# EAGLE design RLCD_SCH_28LED_v1p13p2 (EAGLE 7.1.0)
DATABASE: ../../../../../Documents/eagle/mouserdb.txt
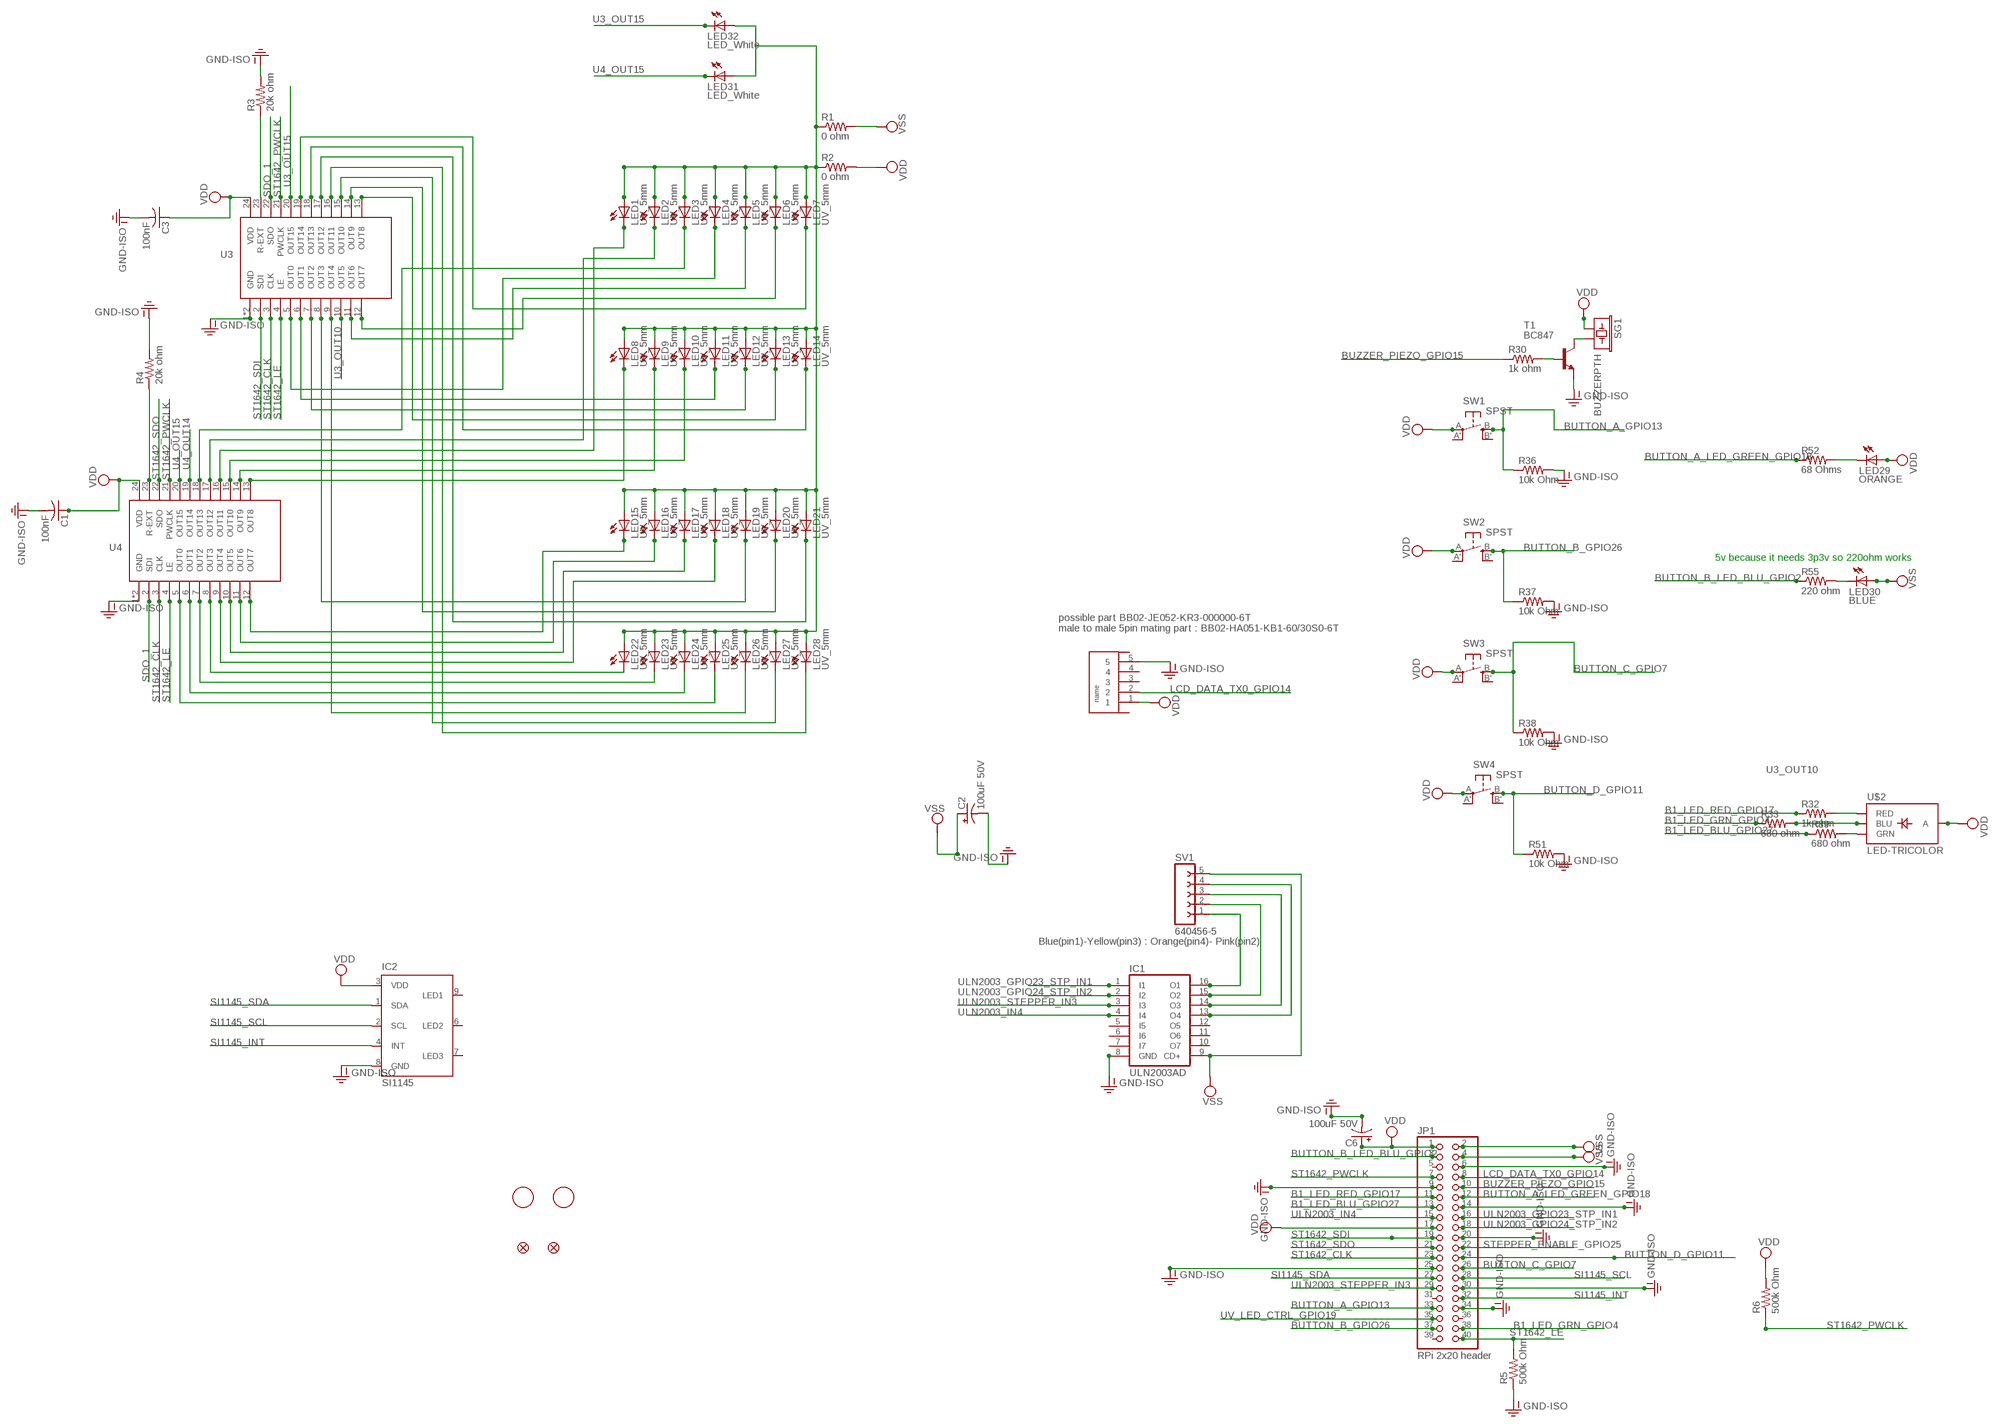
[diagram p0: schematic, sheet 1]

## Parts
C1  100nF  C-USC0805  [C0805]
C2  100uF 50V  CPOL-USE3.5-8  [E3,5-8]
C3  100nF  C-USC0805  [C0805]
C6  100uF 50V  CPOL-USE3.5-8  [E3,5-8]
FID1  FIDUCIAL1X2  [FIDUCIAL-1X2]
FID2  FIDUCIAL1X2  [FIDUCIAL-1X2]
IC1  ULN2003AD  [SO16]
IC2  SI1145  [QFN-10]
JP1  RPi 2x20 header  PINHD-2X20  [2X20]
LED1  UV_5mm  LED5MM  [LED5MM]
LED2  UV_5mm  LED5MM  [LED5MM]
LED3  UV_5mm  LED5MM  [LED5MM]
LED4  UV_5mm  LED5MM  [LED5MM]
LED5  UV_5mm  LED5MM  [LED5MM]
LED6  UV_5mm  LED5MM  [LED5MM]
LED7  UV_5mm  LED5MM  [LED5MM]
LED8  UV_5mm  LED5MM  [LED5MM]
LED9  UV_5mm  LED5MM  [LED5MM]
LED10  UV_5mm  LED5MM  [LED5MM]
LED11  UV_5mm  LED5MM  [LED5MM]
LED12  UV_5mm  LED5MM  [LED5MM]
LED13  UV_5mm  LED5MM  [LED5MM]
LED14  UV_5mm  LED5MM  [LED5MM]
LED15  UV_5mm  LED5MM  [LED5MM]
LED16  UV_5mm  LED5MM  [LED5MM]
LED17  UV_5mm  LED5MM  [LED5MM]
LED18  UV_5mm  LED5MM  [LED5MM]
LED19  UV_5mm  LED5MM  [LED5MM]
LED20  UV_5mm  LED5MM  [LED5MM]
LED21  UV_5mm  LED5MM  [LED5MM]
LED22  UV_5mm  LED5MM  [LED5MM]
LED23  UV_5mm  LED5MM  [LED5MM]
LED24  UV_5mm  LED5MM  [LED5MM]
LED25  UV_5mm  LED5MM  [LED5MM]
LED26  UV_5mm  LED5MM  [LED5MM]
LED27  UV_5mm  LED5MM  [LED5MM]
LED28  UV_5mm  LED5MM  [LED5MM]
LED29  ORANGE  LEDCHIPLED_1206  [CHIPLED_1206]
LED30  BLUE  LEDCHIPLED_1206  [CHIPLED_1206]
LED31  LED_White  LEDCHIPLED_1206  [CHIPLED_1206]
LED32  LED_White  LEDCHIPLED_1206  [CHIPLED_1206]
R1  0 ohm  RESISTOR0805-RES  [0805]
R2  0 ohm  RESISTOR0805-RES  [0805]
R3  20k ohm  RESISTOR0805-RES  [0805]
R4  20k ohm  RESISTOR0805-RES  [0805]
R5  500k Ohm  RESISTOR0805-RES  [0805]
R6  500k Ohm  RESISTOR0805-RES  [0805]
R30  1k ohm  RESISTOR0805-RES  [0805]
R32  1k ohm  RESISTOR0805-RES  [0805]
R33  680 ohm  RESISTOR0805-RES  [0805]
R36  10k Ohm  RESISTOR0805-RES  [0805]
R37  10k Ohm  RESISTOR0805-RES  [0805]
R38  10k Ohm  RESISTOR0805-RES  [0805]
R39  680 ohm  RESISTOR0805-RES  [0805]
R51  10k Ohm  RESISTOR0805-RES  [0805]
R52  68 Ohms  RESISTOR0805-RES  [0805]
R55  220 ohm  RESISTOR0805-RES  [0805]
SG1  BUZZERPTH  [BUZZER-12MM]
SV1  640456-5  FE05-1  [FE05-1]
SV3_LCD_HEADER  22-05-2051  MDF7-5S-2.54DSA  [MDF7-5S-2.54DSA]
SW1  SPST  SPST_TACT-EVQQ2  [EVQ-Q2]
SW2  SPST  SPST_TACT-EVQQ2  [EVQ-Q2]
SW3  SPST  SPST_TACT-EVQQ2  [EVQ-Q2]
SW4  SPST  SPST_TACT-EVQQ2  [EVQ-Q2]
T1  BC847  [SOT23]
U$1  FIDUCIAL  [FIDUCIAL_1MM]
U$2  LED-TRICOLOR  [LED-TRICOLOR-SMD]
U$3  LED1642GWTTR  [TSSOP24]
U$4  LED1642GWTTR  [TSSOP24]
U$5  FIDUCIAL  [FIDUCIAL_1MM]

## Nets
B1_LED_BLU_GPIO27: JP1.13 R39.1
B1_LED_GRN_GPIO4: JP1.38 R33.1
B1_LED_RED_GPIO17: JP1.11 R32.1
BUTTON_A_GPIO13: JP1.33 R36.1 SW1.B(S)
BUTTON_A_LED_GREEN_GPIO18: JP1.12 R52.1
BUTTON_B_GPIO26: JP1.37 R37.1 SW2.B(S)
BUTTON_B_LED_BLU_GPIO2: JP1.3 R55.1
BUTTON_C_GPIO7: JP1.26 R38.1 SW3.B(S)
BUTTON_D_GPIO11: JP1.24 R51.1 SW4.B(S)
BUZZER_PIEZO_GPIO15: JP1.10 R30.1
GND-ISO [GND-ISO]: C1.2 C2.- C3.2 C6.- IC1.8(GND) IC2.8(GND) JP1.6 JP1.9 JP1.14 JP1.20 JP1.25 JP1.30 JP1.34 R3.2 R4.2 R5.1 R36.2 R37.2 R38.2 R51.2 SV3_LCD_HEADER.5 T1.2(E) U$3.1(GND) U$3.P$100(GND) U$4.1(GND) U$4.P$100(GND)
LCD_DATA_TX0_GPIO14: JP1.8 SV3_LCD_HEADER.2
LED+: LED1.A LED2.A LED3.A LED4.A LED5.A LED6.A LED7.A LED8.A LED9.A LED10.A LED11.A LED12.A LED13.A LED14.A LED15.A LED16.A LED17.A LED18.A LED19.A LED20.A LED21.A LED22.A LED23.A LED24.A LED25.A LED26.A LED27.A LED28.A LED31.A LED32.A R1.1 R2.1
N$1: LED2.K(C) U$4.17(OUT12)
N$2: LED3.K(C) U$4.18(OUT13)
N$3: LED6.K(C) U$3.12(OUT7)
N$4: LED4.K(C) U$3.5(OUT0)
N$5: LED5.K(C) U$3.11(OUT6)
N$6: LED22.K(C) U$4.8(OUT3)
N$7: LED15.K(C) U$4.12(OUT7)
N$8: R3.1 U$3.23(R-EXT)
N$9: LED16.K(C) U$4.11(OUT6)
N$10: LED17.K(C) U$4.10(OUT5)
N$11: LED18.K(C) U$4.9(OUT4)
N$12: R4.1 U$4.23(R-EXT)
N$13: LED19.K(C) U$3.8(OUT3)
N$14: LED11.K(C) U$3.6(OUT1)
N$15: LED9.K(C) U$4.14(OUT9)
N$16: LED10.K(C) U$4.15(OUT10)
N$17: LED20.K(C) U$3.14(OUT9)
N$18: LED12.K(C) U$3.7(OUT2)
N$19: R39.2 U$2.G(GRN)
N$20: LED14.K(C) U$3.18(OUT13)
N$21: LED21.K(C) U$3.17(OUT12)
N$23: LED23.K(C) U$4.7(OUT2)
N$24: LED24.K(C) U$4.6(OUT1)
N$25: LED25.K(C) U$4.5(OUT0)
N$26: LED26.K(C) U$3.9(OUT4)
N$27: LED27.K(C) U$3.15(OUT10)
N$28: LED28.K(C) U$3.16(OUT11)
N$29: LED13.K(C) U$3.13(OUT8)
N$30: R30.2 T1.1(B)
N$31: IC1.13(O4) SV1.4
N$33: SG1.- T1.3(C)
N$36: LED7.K(C) U$3.19(OUT14)
N$37: R33.2 U$2.B(BLU)
N$38: IC1.14(O3) SV1.3
N$39: LED29.C R52.2
N$40: LED30.C R55.2
N$41: LED8.K(C) U$4.13(OUT8)
N$47: LED1.K(C) U$4.16(OUT11)
N$58: IC1.16(O1) SV1.1
N$59: IC1.15(O2) SV1.2
SDO_1: U$3.22(SDO) U$4.2(SDI)
SI1145_INT: IC2.4(INT) JP1.32
SI1145_SCL: IC2.2(SCL) JP1.28
SI1145_SDA: IC2.1(SDA) JP1.27
ST1642_CLK: JP1.23 U$3.3(CLK) U$4.3(CLK)
ST1642_LE: JP1.40 R5.2 U$3.4(LE) U$4.4(LE)
ST1642_PWCLK: JP1.7 R6.1 U$3.21(PWCLK) U$4.21(PWCLK)
ST1642_SDI: JP1.19 U$3.2(SDI)
ST1642_SDO: JP1.21 U$4.22(SDO)
STEPPER_ENABLE_GPIO25: JP1.22
U3_OUT10: R32.2 U$2.R(RED) U$3.10(OUT5)
U3_OUT15: LED32.C U$3.20(OUT15)
U4_OUT14: U$4.19(OUT14)
U4_OUT15: LED31.C U$4.20(OUT15)
ULN2003_GPIO23_STP_IN1: IC1.1(I1) JP1.16
ULN2003_GPIO24_STP_IN2: IC1.2(I2) JP1.18
ULN2003_IN4: IC1.4(I4) JP1.15
ULN2003_STEPPER_IN3: IC1.3(I3) JP1.29
UV_LED_CTRL_GPIO19: JP1.35
VDD: C1.1 C3.1 C6.+ IC2.3(VDD) JP1.1 JP1.17 LED29.A R2.2 R6.2 SG1.+ SV3_LCD_HEADER.1 SW1.A(P) SW2.A(P) SW3.A(P) SW4.A(P) U$2.A U$3.24(VDD) U$4.24(VDD)
VSS: C2.+ IC1.9(CD+) JP1.2 JP1.4 LED30.A R1.2 SV1.5
Unconnected: IC1.5(I5) IC1.6(I6) IC1.7(I7) IC1.10(O7) IC1.11(O6) IC1.12(O5) IC2.6(LED2) IC2.7(LED3) IC2.9(LED1) JP1.5 JP1.31 JP1.36 JP1.39 SV3_LCD_HEADER.3 SV3_LCD_HEADER.4 SW1.A'(P1) SW1.B'(S1) SW2.A'(P1) SW2.B'(S1) SW3.A'(P1) SW3.B'(S1) SW4.A'(P1) SW4.B'(S1)

## Notes on the sheet
- U3
- U4
- 5v because it needs 3p3v so 220ohm works
- possible part BB02-JE052-KR3-000000-6T
  male to male 5pin mating part : BB02-HA051-KB1-60/30S0-6T
- Blue(pin1)-Yellow(pin3) : Orange(pin4)- Pink(pin2)

## Library data of the parts
C1 C3 = resistor:C-US: CAPACITOR, American symbol
C2 C6 = adafruit:CPOL-US: POLARIZED CAPACITOR, American symbol; PARTNO: REA101M1HBK-0811P
FID1 FID2 = SparkFun-Aesthetics:FIDUCIAL: Fiducial Alignment Points Various fiducial points for machine vision alignment.
IC1 = uln-udn:ULN2003A: DRIVER ARRAY
IC2 = silabs:SI114*: PROXIMITY/UV/AMBIENT LIGHT SENSOR IC WITH I2C INTERFACE Source: http://www.silabs.com/Support%20Documents/TechnicalDocs/Si1145-46-47.pdf
JP1 = adafruit:PINHD-2X20: PIN HEADER; PARTNO: 929975-01-13-RK
LED1-LED28 = led:LED: LED; PARTNO: *
LED29 LED31 LED32 = adafruit:LED: LED; PARTNO: LG N971-KN-1
LED30 = adafruit:LED: LED; PARTNO: LTST-C21TBKT
R1-R4 = SparkFun-Passives:RESISTOR: Resistor Basic schematic elements and footprints for 0603, 1206, and PTH resistors.; PARTNO: DNP
R5 R6 R36-R38 R51 = SparkFun-Passives:RESISTOR: Resistor Basic schematic elements and footprints for 0603, 1206, and PTH resistors.; PARTNO: RK73B2ATTD103J
R30 R32 = SparkFun-Passives:RESISTOR: Resistor Basic schematic elements and footprints for 0603, 1206, and PTH resistors.; PARTNO: RK73H2ATTD1001F
R33 R39 = SparkFun-Passives:RESISTOR: Resistor Basic schematic elements and footprints for 0603, 1206, and PTH resistors.; PARTNO: RK73B2ATTD681J
R52 = SparkFun-Passives:RESISTOR: Resistor Basic schematic elements and footprints for 0603, 1206, and PTH resistors.; PARTNO: RK73B2ATTDD121J
R55 = SparkFun-Passives:RESISTOR: Resistor Basic schematic elements and footprints for 0603, 1206, and PTH resistors.; PARTNO: RK73B2ATTD221J
SG1 = SparkFun-Electromechanical:BUZZER: Buzzer 12mm Spark Fun Electronics SKU : Comp-Buzzer; PARTNO: AT-1220-TT-R
SV1 = con-lsta:FE05-1: FEMALE HEADER; OC_FARNELL: unknown; OC_NEWARK: unknown; PARTNO: 640456-5
SV3_LCD_HEADER = Trents_Hirose_5pin_2.54mm_Connector:MDF7-5S-2.54DSA; PARTNO: MDF7-5S-2.54DSA(55)
SW1-SW4 = adafruit:SPST_TACT: SMT 6mm switch, EVQQ2 series http://www.ladyada.net/library/eagle
T1 = transistor:BC847: NPN TRANSISTOR; PARTNO: MMUN2214LT1G
U$1 U$5 = adafruit:FIDUCIAL: For use by pick and place machines to calibrate the vision/machine, 1mm By microbuilder.eu
U$2 = SparkFun-LED:LED-TRICOLOR: Tri-Color LED SMD Proven layout and schematic for triple color LED in SMD package - common anode. Spark Fun Electronics SKU : COM-07844; PARTNO: CLV1A-FKB-CHMKPEHBB7A363
U$3 U$4 = iBox_Nano_Custom_Components:LED1642GWTTR

## Net classes
1 GND-ISO: width 0.008 mm

## Board
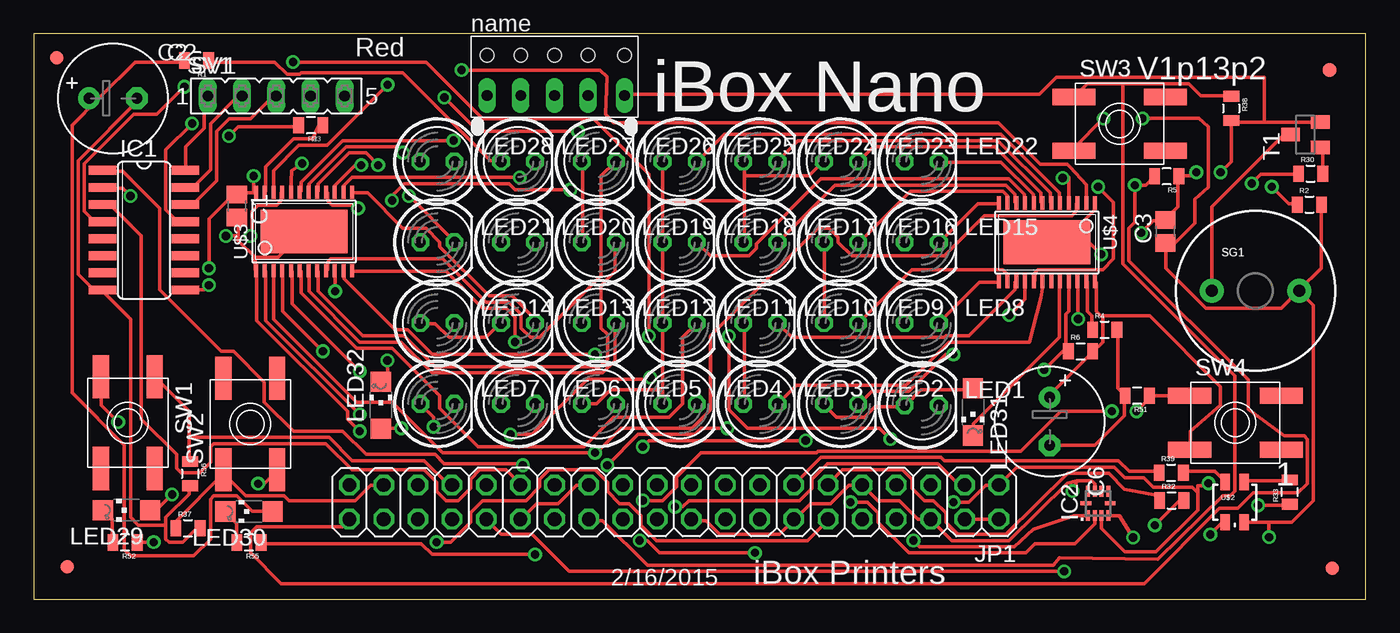
[diagram p1: board, top side]
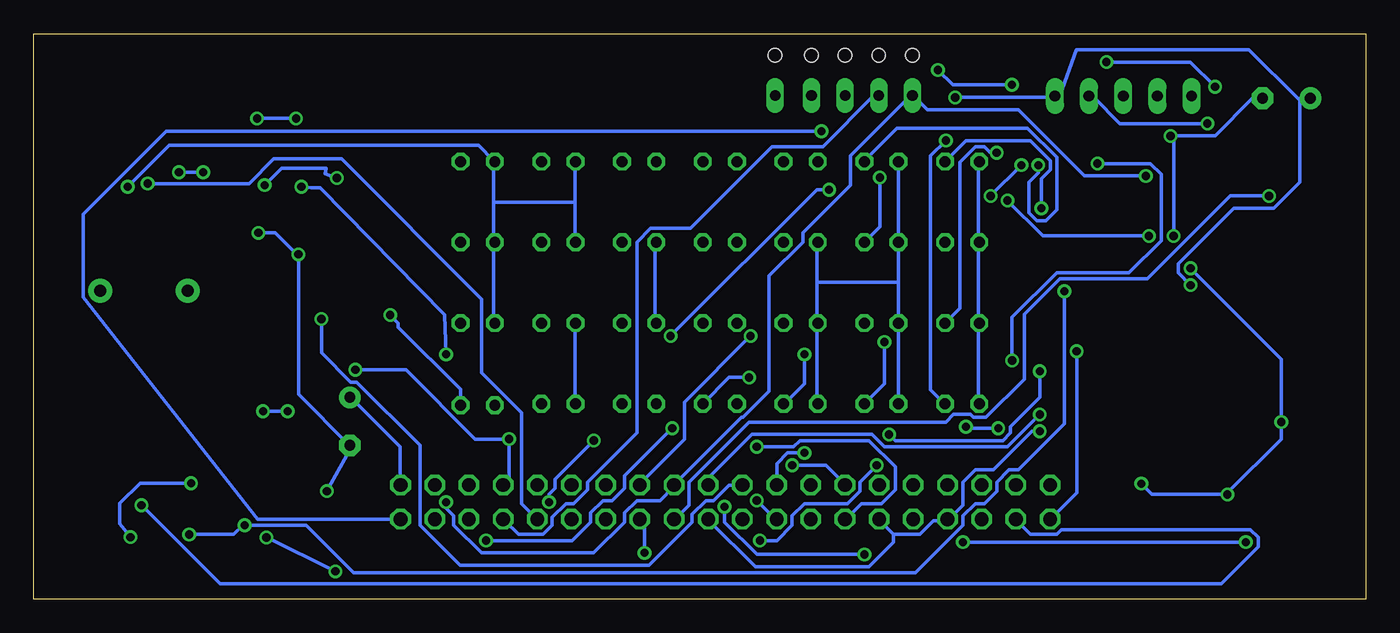
[diagram p2: board, bottom side, seen from below]

Size 99 x 42 mm. Coordinates in mm from the lower left corner, seen from the top.
Outline: 0,0 99,0 99,42 0,42 0,0
Copper layers (1*16): Top 0.035mm / dielectric 1.5mm / Bottom 0.035mm
Design rules "default": minimum track width 10mil, minimum drill 24mil, track to track 8mil, track to pad 8mil, pad to pad 8mil, via to via 8mil, smd to smd 8mil, copper to edge 40mil, drill to drill 8mil, minimum pad ring 10mil, minimum via ring 8mil, stop-mask expansion 4mil, vias tented up to drill 0mil, thermal gap 10mil

### Footprints (pad centres in the part's own frame; a part is rotated, then mirrored left to right if it is on the bottom)
C0805 = smd 1.3 x 1.5: 1 -0.85,0; 2 0.85,0
E3,5-8 = drill 0.813 pad 1.6: + -1.778,0 | drill 0.813 pad 1.6 octagon: - 1.778,0
FIDUCIAL-1X2 = smd 1 x 1: 1 0,0
SO16 = smd 0.66 x 2.032: 1 -4.445,-3.073; 2 -3.175,-3.073; 3 -1.905,-3.073; 4 -0.635,-3.073; 5 0.635,-3.073; 6 1.905,-3.073; 7 3.175,-3.073; 8 4.445,-3.073; 9 4.445,3.073; 10 3.175,3.073; 11 1.905,3.073; 12 0.635,3.073; 13 -0.635,3.073; 14 -1.905,3.073; 15 -3.175,3.073; 16 -4.445,3.073
QFN-10 = smd 0.8 x 0.3: 1 -0.9,0.75; 2 -0.9,0.25; 3 -0.9,-0.25; 4 -0.9,-0.75; 6 0.9,-0.75; 7 0.9,-0.25; 8 0.9,0.25; 9 0.9,0.75 | smd 0.3 x 0.8: 5 0,-0.9; 10 0,0.9
2X20 = drill 1.016 octagon: 1 -24.13,-1.27; 2 -24.13,1.27; 3 -21.59,-1.27; 4 -21.59,1.27; 5 -19.05,-1.27; 6 -19.05,1.27; 7 -16.51,-1.27; 8 -16.51,1.27; 9 -13.97,-1.27; 10 -13.97,1.27; 11 -11.43,-1.27; 12 -11.43,1.27; 13 -8.89,-1.27; 14 -8.89,1.27; 15 -6.35,-1.27; 16 -6.35,1.27; 17 -3.81,-1.27; 18 -3.81,1.27; 19 -1.27,-1.27; 20 -1.27,1.27; 21 1.27,-1.27; 22 1.27,1.27; 23 3.81,-1.27; 24 3.81,1.27; 25 6.35,-1.27; 26 6.35,1.27; 27 8.89,-1.27; 28 8.89,1.27; 29 11.43,-1.27; 30 11.43,1.27; 31 13.97,-1.27; 32 13.97,1.27; 33 16.51,-1.27; 34 16.51,1.27; 35 19.05,-1.27; 36 19.05,1.27; 37 21.59,-1.27; 38 21.59,1.27; 39 24.13,-1.27; 40 24.13,1.27
LED5MM = drill 0.813 octagon: A -1.27,0; K 1.27,0
CHIPLED_1206 = smd 1.5 x 1.5: A 0,-1.75; C 0,1.75
0805 = smd 0.8 x 1.2: 1 -0.9,0; 2 0.9,0
BUZZER-12MM = drill 0.9 pad 1.778: + 3.25,0; - -3.25,0
FE05-1 = drill 0.813 long: 1 -5.08,0; 2 -2.54,0; 3 0,0; 4 2.54,0; 5 5.08,0
MDF7-5S-2.54DSA = drill 0.8 long: 1 1.2,1.6; 2 3.7,1.6; 3 6.2,1.6; 4 8.7,1.6; 5 11.4,1.6 | hole 1: 1.2,4.6; 3.7,4.6; 6.2,4.6; 8.7,4.6; 11.4,4.6
EVQ-Q2 = smd 3.2 x 1.2: A -3.4,-2; A' 3.4,-2; B -3.4,2; B' 3.4,2
SOT23 = smd 1 x 1.4: 1 -0.95,-1.1; 2 0.95,-1.1; 3 0,1.1
FIDUCIAL_1MM = smd 1 x 1: 1 0,0
LED-TRICOLOR-SMD = smd 0.7 x 1.2: A 0.7,-1.5; B 0.7,1.5; G -0.7,1.5; R -0.7,-1.5
TSSOP24 = smd 0.305 x 0.991: 1 -3.575,-2.918; 2 -2.925,-2.918; 3 -2.275,-2.918; 4 -1.625,-2.918; 5 -0.975,-2.918; 6 -0.325,-2.918; 7 0.325,-2.918; 8 0.975,-2.918; 9 1.625,-2.918; 10 2.275,-2.918; 11 2.925,-2.918; 12 3.575,-2.918; 13 3.575,2.918; 14 2.925,2.918; 15 2.275,2.918; 16 1.625,2.918; 17 0.975,2.918; 18 0.325,2.918; 19 -0.325,2.918; 20 -0.975,2.918; 21 -1.625,2.918; 22 -2.275,2.918; 23 -2.925,2.918; 24 -3.575,2.918 | smd 6.452 x 3.251: P$100 0,0

### Placement (x,y rotation side)
C1  15.1,29.2 270 top
C2  5.9,37.2 0 top
C3  84.1,27.3 90 top
C6  75.5,13.2 270 top
FID1  96.5,2.3 0 top
FID2  1.7,40.2 0 top
IC1  8.2,27.4 270 top
IC2  79.1,7.1 90 top
JP1  47.6,7.2 180 top
LED1  66,14.4 0 top
LED2  60,14.5 0 top
LED3  54,14.5 0 top
LED4  48,14.5 0 top
LED5  42,14.5 0 top
LED6  36,14.5 0 top
LED7  30,14.5 0 top
LED8  66,20.5 0 top
LED9  60,20.5 0 top
LED10  54,20.5 0 top
LED11  48,20.5 0 top
LED12  42,20.5 0 top
LED13  36,20.5 0 top
LED14  30,20.5 0 top
LED15  66,26.5 0 top
LED16  60,26.5 0 top
LED17  54,26.5 0 top
LED18  48,26.5 0 top
LED19  42,26.5 0 top
LED20  36,26.5 0 top
LED21  30,26.5 0 top
LED22  66,32.5 0 top
LED23  60,32.5 0 top
LED24  54,32.5 0 top
LED25  48,32.5 0 top
LED26  42,32.5 0 top
LED27  36,32.5 0 top
LED28  30,32.5 0 top
LED29  6.9,6.6 90 top
LED30  16,6.5 90 top
LED31  69.8,13.9 180 top
LED32  25.8,14.4 0 top
R1  12.1,40 180 top
R2  94.8,29.3 0 top
R3  20.6,35.2 180 top
R4  79.6,20 0 top
R5  84.2,31.4 180 top
R6  77.8,18.4 0 top
R30  94.9,31.6 0 top
R32  84.57,7.32 0 top
R33  93.34,7.95 90 top
R36  11.63,9.31 270 top
R37  11.47,5.26 0 top
R38  88.99,36.45 270 top
R39  84.53,9.38 0 top
R51  82,15.1 180 top
R52  6.8,4.2 180 top
R55  16,4.2 180 top
SG1  90.8,22.9 0 top
SV1  18.03,37.37 0 top
SV3_LCD_HEADER  32.5,35.8 0 top
SW1  7,13.1 270 top
SW2  16.1,13 90 top
SW3  80.7,35.3 0 top
SW4  89.3,13.1 0 top
T1  94.5,34.5 90 top
U$1  2.5,2.4 0 top
U$2  89.25,7.2 0 top
U$3  20.1,27.3 0 top
U$4  75.3,26.5 180 top
U$5  96.3,39.3 0 top

### Tracks (layer width: path | path; a pad name or v marks a point on that pad's centre or on a via)
B1_LED_BLU_GPIO27
  Top 0.254: R39.1 83.55,9.49 81.42,9.49 80.62,10.29 67.67,10.29 67.44,10.52 58.52,10.52 56.58,8.57 JP1.13
B1_LED_GRN_GPIO4  (via drill 0.61)
  Top 0.254: v90.98,6.97 93.27,6.97 R33.1
  Bottom 0.254: v90.98,6.97 85.15,1.14 10.74,1.14 8,3.89 8,4.57 8.57,5.14 22.63,5.14 22.97,4.8 24.92,4.8 25.95,5.83 JP1.38
B1_LED_RED_GPIO17
  Top 0.254: R32.1 83.67,7.66 81.07,8.16 79.9,9.33 76.87,9.33 72.24,4.8 68.69,4.8 67.78,5.71 67.78,6.4 66.86,7.32 66.18,7.32 65.27,8.23 65.27,8.91 64.58,9.6 60.12,9.6 59.09,8.57 JP1.11
BUTTON_A_GPIO13
  Top 0.254: 11.54,12 11.54,13.95 9.03,16.46 SW1.B | 11.54,12 11.54,10.29 R36.1 | 11.54,12 21.95,12 23.66,10.29 29.03,10.29 30.75,8.57 31.09,8.57 JP1.33
BUTTON_A_LED_GREEN_GPIO18  (via drill 0.61)
  Top 0.254: v8.91,4.23 7.77,4.23 R52.1 | v29.95,4.23 30.98,4.23 32.46,5.71 32.46,6.4 33.38,7.32 36.58,7.32 37.6,8.34 37.6,8.91 38.29,9.6 41.72,9.6 42.63,8.69 42.63,8 43.55,7.09 44.23,7.09 45.15,6.17 45.15,5.49 46.29,4.34 57.49,4.34 58.98,5.83 JP1.12
  Bottom 0.254: v29.95,4.23 v8.91,4.23
BUTTON_B_GPIO26
  Top 0.254: R37.1 10.63,5.37 10.63,5.83 14.06,9.26 14.06,9.49 SW2.B 14.17,9.26 15.77,7.66 18.63,7.66 18.97,7.32 23.89,7.32 25.03,8.46 25.95,8.46 JP1.37
BUTTON_B_LED_BLU_GPIO2  (via drill 0.61)
  Top 0.254: v37.26,3.31 29.6,3.31 28.8,4.12 16.92,4.12 R55.1 | v47.66,6.86 48.23,6.86 48.69,7.32 56.92,7.32 57.84,8.23 57.84,8.91 58.98,10.06 67.21,10.06 68.69,8.57 69.15,8.57 JP1.3
  Bottom 0.254: v37.26,3.31 45.26,3.31 47.66,5.71 v47.66,6.86
BUTTON_C_GPIO7
  Top 0.254: 80.92,38.29 78.3,38.29 77.38,37.38 SW3.B | 80.92,38.29 85.84,38.29 86.75,37.38 88.92,37.38 R38.1 | 80.92,38.29 80.92,24.92 89.27,16.57 89.27,8 88.92,7.66 88.35,7.66 83.55,2.96 76.22,3.06 75.78,2.52 45.61,2.52 42.29,5.83 41.26,5.83 JP1.26
BUTTON_D_GPIO11  (via drill 0.61)
  Top 0.254: SW4.B 85.84,15.09 82.98,15.09 R51.1 82.98,14.97 v81.95,13.95 | v45.26,7.32 46.75,7.32 47.78,8.34 47.78,9.03 49.61,10.86 58.18,10.86 58.29,10.97 73.38,10.97 76.35,13.95 v80.12,13.95
  Bottom 0.254: v45.26,7.32 43.89,5.94 JP1.24 | v81.95,13.95 v80.12,13.95
BUZZER_PIEZO_GPIO15  (via drill 0.61)
  Top 0.254: v90.53,30.86 91.21,31.55 93.95,31.55 R30.1
  Bottom 0.254: v90.53,30.86 82.98,30.86 81.15,32.69 76.12,32.69 65.72,22.29 65.72,16.8 62.75,13.83 62.75,7.09 61.61,5.94 JP1.10
GND-ISO  (via drill 0.61)
  Top 0.254: 88.92,35.2 88.92,35.55 R38.2 | 91.45,35.43 89.04,35.43 R38.2 | 91.45,35.43 95.56,35.43 T1.2 | 91.45,35.43 91.45,38.75 89.15,38.75 76.01,38.75 74.75,37.49 44.01,37.49 SV3_LCD_HEADER.5 | 16.46,25.38 16.46,24.46 U$3.1 16.57,24.35 16.57,20.69 23.32,13.95 23.32,13.37 v24.23,12.46 | 16.46,25.38 15.2,26.63 15.2,26.98 | 15.2,26.98 15.2,28.35 C1.2 | 16.46,25.38 18.17,25.38 20,27.2 U$3.P$100 | 9.83,5.49 9.83,6.06 11.54,7.77 11.54,8.34 R36.2 | 9.83,5.49 9.83,4.46 10.06,4.23 11.09,4.23 12.12,5.26 12.34,5.26 R37.2 | v14.52,34.4 15.2,35.09 19.32,35.09 R3.2 | C2.- 8.34,37.15 7.89,37.15 3.31,32.58 3.31,24.12 4.46,22.97 5.03,22.97 IC1.8 5.14,22.86 7.2,20.8 7.2,6.06 7.77,5.49 9.83,5.49 | v14.29,26.98 15.2,26.98 | U$4.1 78.87,29.38 78.87,28.92 76.47,26.52 75.32,26.52 U$4.P$100 77.5,27.43 v79.32,25.6 | R4.2 80.58,19.89 80.58,15.66 81.04,15.2 R51.2 81.04,15.09 81.04,13.6 78.87,11.43 75.55,11.43 C6.- | JP1.25 41.15,8.46 40.35,8.46 38.98,7.09 37.38,7.09 36.23,5.94 JP1.30 | 77.51,8.8 76.82,8.6 72.47,4.34 68.24,4.34 66.75,5.83 JP1.6 66.64,5.94 65.72,5.94 64.35,7.32 62.75,7.32 61.61,8.46 JP1.9 61.49,8.46 60.58,8.46 59.21,7.09 57.72,7.09 56.58,5.94 JP1.14 56.46,5.83 55.44,4.8 50.98,4.8 49.95,5.83 48.92,5.83 JP1.20 | 77.51,8.8 78.64,8.8 78.87,8.57 78.87,8 IC2.8 | v77.21,8.02 77.51,8.8 | v82.3,27.2 83.21,28.12 84.01,28.12 C3.2 84.12,28.23 85.04,29.15 85.04,31.32 R5.1 85.15,31.43 86.13,31.43 v86.4,31.7 | R38.2 88.99,32.49 v88.2,31.7
  Bottom 0.254: C2.- 8.46,37.15 11.2,34.4 v14.52,34.4 14.29,34.29 v14.29,26.98 | 35.09,4.8 33.15,4.8 32.12,5.83 31.2,5.83 JP1.34 30.98,5.94 29.95,6.97 29.95,8.69 29.03,9.6 27.66,9.6 24.8,12.46 v24.23,12.46 | 35.09,4.8 36.12,5.83 JP1.30 | 35.09,4.8 35.09,4.23 36.92,2.4 45.38,2.4 48.81,5.83 JP1.20 | v77.21,8.02 75.55,10.97 75.55,11.32 C6.- 75.55,11.43 79.32,15.2 v79.32,25.6 79.44,25.6 81.04,27.2 v82.3,27.2 | v88.2,31.7 v86.4,31.7
LCD_DATA_TX0_GPIO14
  Bottom 0.254: SV3_LCD_HEADER.2 36.23,37.38 36.58,37.38 40.35,33.6 44.12,33.6 50.18,27.55 53.15,27.55 54.18,26.52 54.18,12.34 57.84,8.69 57.84,8.12 58.86,7.09 59.44,7.09 60.47,6.06 60.47,5.49 61.15,4.8 62.98,4.8 64.01,5.83 JP1.8
LED+  (via drill 0.61)
  Top 0.254: R1.1 13.03,39.89 17.92,39.89 18.83,38.98 19.77,38.98 19.89,39.09 27.43,39.09 33.95,32.58 34.63,32.58 LED27.A | v27.32,12.69 25.83,12.69 LED32.A | v29.72,12.8 29.72,13.49 28.8,14.4 LED7.A | LED26.A 40.8,32.46 40.8,26.52 LED19.A | LED14.A 28.8,20.46 29.83,20.46 30.86,19.43 33.6,19.43 34.63,20.46 LED13.A | v92.01,30.63 93.27,29.38 93.84,29.38 R2.1 | 46.75,15.54 46.75,20.46 LED11.A 46.75,20.57 46.75,26.4 LED18.A 46.75,26.63 46.75,29.6 | 46.75,15.54 46.75,14.52 LED4.A | 46.75,29.6 46.75,32.46 LED25.A | LED3.A 52.81,14.52 52.81,20.46 LED10.A | 52.81,29.6 52.81,26.52 LED17.A | 52.81,29.6 52.81,31.43 | 52.81,31.43 52.81,32.46 LED24.A | 52.81,29.6 46.75,29.6 | LED31.A 69.72,15.54 65.95,15.54 64.81,14.4 LED1.A 64.69,14.29 62.52,14.29 61.72,13.49 59.66,13.49 58.75,14.4 LED2.A | LED16.A 58.75,26.4 58.75,20.57 LED9.A | 52.81,31.43 57.61,31.43 58.64,32.46 LED23.A | 46.75,15.54 42.86,15.54 41.83,14.52 40.8,14.52 LED5.A
  Bottom 0.254: v27.32,12.69 29.6,12.69 v29.72,12.8 | LED28.A 28.8,32.46 28.8,26.52 LED21.A 28.8,26.4 28.8,20.57 LED14.A 28.8,20.46 28.8,14.52 LED7.A | LED6.A 34.75,14.52 34.75,20.46 LED13.A 34.75,20.57 34.75,23.55 | 34.75,23.55 34.75,26.4 LED20.A 34.75,26.63 34.75,32.46 LED27.A | LED5.A 40.8,14.52 40.8,20.46 LED12.A 40.8,20.57 40.8,23.55 | 40.8,23.55 40.8,26.4 LED19.A | 40.8,23.55 34.75,23.55 | LED8.A 64.81,20.57 64.81,26.4 LED15.A 64.81,26.52 64.81,29.49 | v92.01,30.63 88.92,33.72 65.95,33.72 64.81,32.58 LED22.A 64.81,32.46 64.81,29.49 | LED17.A 52.81,26.4 52.81,20.57 LED10.A | LED2.A 58.75,14.52 58.75,20.46 LED9.A | 58.75,29.49 58.75,26.52 LED16.A | 58.75,29.49 58.75,32.46 LED23.A | 58.75,29.49 64.81,29.49
N$1  (via drill 0.61)
  Top 0.254: v79.1,30.63 80.24,29.49 80.24,25.26 79.44,24.46 74.64,24.46 74.41,24.23 74.41,23.66 U$4.17 | v68.35,18.17 67.78,18.17 65.04,15.43 62.29,15.43 61.38,14.52 LED2.K
  Bottom 0.254: v79.1,30.63 78.38,30.55 77.69,30.55 68.45,21.1 v68.35,18.17
N$2
  Top 0.254: U$4.18 74.97,23.05 74.87,22.37 73.98,19.09 68.01,19.09 64.81,15.89 56.69,15.89 55.32,14.52 LED3.K
N$3  (via drill 0.61)
  Top 0.254: v35.78,19.09 35.78,20.92 35.09,21.6 33.38,21.6 30.63,24.35 23.77,24.35 U$3.12
  Bottom 0.254: v35.78,19.09 35.78,16 37.26,14.52 LED6.K
N$4  (via drill 0.61)
  Top 0.254: v24.23,16.92 19.2,21.95 19.2,24.35 U$3.5 | v35.43,12.23 37.03,12.23 41.15,16.34 45.72,16.34 v45.83,16.46
  Bottom 0.254: v24.23,16.92 24.23,14.97 26.4,12.8 26.4,12.34 26.98,11.77 34.98,11.77 v35.43,12.23 | v45.83,16.46 47.32,16.46 49.26,14.52 LED4.K
N$5  (via drill 0.61)
  Top 0.254: v41.72,18.17 29.6,18.17 27.77,20 26.86,20 23.09,23.77 23.09,24.35 U$3.11
  Bottom 0.254: v41.72,18.17 41.72,16 43.2,14.52 LED5.K
N$6
  Top 0.254: U$4.8 74.3,29.49 74.3,30.06 71.89,32.46 67.32,32.46 LED22.K
N$7
  Top 0.254: U$4.12 71.67,29.38 70.18,29.38 67.32,26.52 LED15.K
N$8
  Top 0.254: U$3.23 17.26,30.29 17.26,32.12 19.32,34.18 20.73,34.18 21.14,35.09 R3.1
N$9
  Top 0.254: U$4.11 72.35,29.49 72.35,29.95 72.01,30.29 65.15,30.29 61.38,26.52 LED16.K
N$10
  Top 0.254: U$4.10 72.92,29.49 72.92,30.06 72.24,30.75 59.55,30.75 55.32,26.52 LED17.K
N$11
  Top 0.254: U$4.9 73.61,29.49 73.61,30.06 72.47,31.2 58.52,31.2 53.72,26.4 53.72,26.06 53.15,25.49 50.29,25.49 49.38,26.4 LED18.K
N$12
  Top 0.254: U$4.23 78.3,23.55 78.3,21.37 78.64,21.03 78.64,20 R4.1
N$13
  Top 0.254: U$3.8 21.14,24.35 21.14,22.86 24.46,19.55 27.55,19.55 29.83,17.26 42.06,17.26 42.63,17.83 42.63,19.66 42.18,20.12 42.18,23.32 43.2,24.35 43.2,26.4 LED19.K
N$14
  Top 0.254: U$3.6 19.89,24.35 19.89,22.75 24,18.63 26.63,18.63 30.18,15.09 30.18,14.17 33.03,11.32 40.92,11.32 43.09,13.49 47.21,13.49 48.23,14.52 48.23,19.43 49.26,20.46 LED11.K
N$15
  Top 0.254: U$4.14 72.35,23.66 72.35,24.12 72.01,24.46 65.27,24.46 61.38,20.57 LED9.K
N$16
  Top 0.254: U$4.15 72.92,23.55 72.92,22.97 69.49,19.55 67.78,19.55 67.67,19.43 56.35,19.43 55.32,20.46 LED10.K
N$17  (via drill 0.61)
  Top 0.254: v36.12,31.32 23.66,31.32 23.09,30.75 23.09,30.29 U$3.14
  Bottom 0.254: v36.12,31.32 36.12,27.66 37.26,26.52 LED20.K
N$18
  Top 0.254: U$3.7 20.46,24.35 20.46,22.86 24.23,19.09 27.32,19.09 29.6,16.8 42.29,16.8 43.2,17.72 43.2,20.46 LED12.K
N$19
  Top 0.254: U$2.G 88.47,8.8 87.78,9.49 85.5,9.49 R39.2
N$20  (via drill 0.61)
  Top 0.254: v27.43,33.15 26.98,33.6 23.2,33.6 20.46,30.86 20.46,30.29 U$3.18
  Bottom 0.254: v27.43,33.15 27.89,33.15 28.35,33.6 29.03,33.6 30.18,32.46 30.18,21.6 31.2,20.57 LED14.K
N$21  (via drill 0.61)
  Top 0.254: v25.6,32.23 24.69,33.15 23.43,33.15 21.14,30.86 21.14,30.29 U$3.17 | v27.89,29.95 31.32,26.52 LED21.K
  Bottom 0.254: v27.89,29.95 v25.6,32.23
N$23
  Top 0.254: U$4.7 74.87,29.49 74.87,30.18 71.44,33.6 62.41,33.6 61.38,32.58 LED23.K
N$24
  Top 0.254: U$4.6 75.55,29.49 75.55,30.18 71.67,34.06 56.81,34.06 55.32,32.58 LED24.K
N$25
  Top 0.254: U$4.5 76.24,29.49 76.24,30.18 71.89,34.52 51.32,34.52 49.38,32.58 LED25.K
N$26
  Top 0.254: U$3.9 21.83,24.46 21.83,25.03 22.06,25.26 30.4,25.26 33.6,22.06 35.32,22.06 36.23,21.14 36.23,20.12 36.92,19.43 37.6,19.43 42.18,24 42.18,31.43 43.2,32.46 LED26.K
N$27  (via drill 0.61)
  Top 0.254: v24.35,32.23 23.89,32.23 22.4,30.75 22.4,30.29 U$3.15
  Bottom 0.254: v24.35,32.23 24.35,31.66 25.03,30.98 25.03,28.69 24.46,28.12 23.77,28.12 22.97,28.92 22.97,32.8 25.15,34.98 34.86,34.98 37.26,32.58 LED27.K
N$28  (via drill 0.61)
  Top 0.254: v24.12,29.03 23.89,29.26 22.17,29.26 21.83,29.6 21.83,30.18 U$3.16
  Bottom 0.254: v24.12,29.03 24.12,31.2 23.43,31.89 23.43,32.58 24.92,34.06 29.72,34.06 31.2,32.58 LED28.K
N$29
  Top 0.254: U$3.13 23.77,30.18 24.8,30.18 27.43,27.55 29.15,27.55 30.18,26.52 30.18,26.18 33.83,22.52 35.55,22.52 37.26,20.8 37.26,20.57 LED13.K
N$30
  Top 0.254: R30.2 95.78,31.66 95.78,33.38 95.67,33.49 T1.1
N$31  (via drill 0.61)
  Top 0.254: v11.77,35.32 9.83,33.38 9.83,28.92 10.63,28.12 11.2,28.12 IC1.13
  Bottom 0.254: v11.77,35.32 18.29,35.32 20.23,37.26 SV1.4
N$33
  Top 0.254: T1.3 93.38,34.4 92.81,34.4 87.55,29.15 87.55,22.97 SG1.-
N$36  (via drill 0.61)
  Top 0.254: v31.2,34.06 22.97,34.06 19.89,30.98 19.89,30.29 U$3.19
  Bottom 0.254: v31.2,34.06 32.35,32.92 32.35,15.54 31.32,14.52 LED7.K
N$37
  Top 0.254: U$2.B 89.95,8.8 93.27,8.8 R33.2
N$38
  Top 0.254: IC1.14 11.32,29.38 11.89,29.38 13.6,31.09 13.6,34.75 14.52,35.66 16.12,35.66 17.72,37.26 SV1.3
N$39
  Top 0.254: R52.2 5.83,4.23 5.83,5.94 5.26,6.51 LED29.C
N$40
  Top 0.254: R55.2 15.09,4.23 15.09,5.6 14.29,6.4 LED30.C
N$41
  Top 0.254: U$4.13 71.67,23.55 70.29,23.55 67.32,20.57 LED8.K
N$47  (via drill 0.61)
  Top 0.254: U$4.16 73.67,22.27 v72.5,21.1
  Bottom 0.254: LED1.K 67.27,15.57 71.9,20.2 71.9,20.5 v72.5,21.1
N$58
  Top 0.254: IC1.16 11.32,31.89 11.32,33.6 12.69,34.98 12.69,37.26 SV1.1
N$59
  Top 0.254: IC1.15 11.32,30.63 11.89,30.63 13.14,31.89 13.14,35.32 15.09,37.26 SV1.2
SDO_1  (via drill 0.61)
  Top 0.254: U$4.2 78.22,30.77 77,32.1 76.8,32.3 74.8,32.3 71.7,35.4 43.1,35.4 42.5,36 42.6,38.8 42.1,39.3 v31.8,39.3 | U$3.22 17.82,31.82 19.7,33.7 21.8,33.7 v26.3,38.2
  Bottom 0.254: v26.3,38.2 30.7,38.2 v31.8,39.3
SI1145_INT  (via drill 0.61)
  Top 0.254: v81.7,4.57 80.7,6.17 79.9,6.17 IC2.4 | v76.58,2.06 39.78,2.06 37.03,4.8 34.75,4.8 33.72,5.83 JP1.32
  Bottom 0.254: v76.58,2.06 v81.7,4.57
SI1145_SCL  (via drill 0.61)
  Top 0.254: v60.69,7.2 61.95,7.2 62.75,6.4 62.75,5.71 65.04,3.43 73.72,3.43 74.41,4.12 77.38,4.12 78.87,5.6 78.87,6.17 IC2.2 | v57.38,11.77 45.72,11.77 v45.26,11.32
  Bottom 0.254: v60.69,7.2 60.69,7.77 60.24,8.23 60.24,8.91 v57.38,11.77 | v45.26,11.32 42.52,11.32 42.06,11.77 36.92,11.77 34.98,9.83 34.98,8.12 36.01,7.09 37.49,7.09 38.63,5.94 JP1.28
SI1145_SDA  (via drill 0.61)
  Top 0.254: v65.38,4.34 65.84,3.89 72.89,3.89 74.3,5.2 77.3,6.17 78.3,6.17 IC2.1 | v51.55,12.69 49.61,12.69 49.15,12.23 44.92,12.23 v42.63,9.94
  Bottom 0.254: v65.38,4.34 58.98,4.34 57.61,5.71 57.61,6.4 56.69,7.32 56.01,7.32 55.09,8.23 55.09,9.14 v51.55,12.69 | v42.63,9.94 40.12,9.94 38.75,8.57 JP1.27
ST1642_CLK  (via drill 0.61)
  Top 0.254: U$3.3 17.83,24.35 17.83,20.8 24,14.63 26.63,14.63 30.4,10.86 v41.72,10.86 41.83,10.86 43.66,12.69 48.92,12.69 50.29,14.06 50.29,19.55 58.29,27.55 59.09,27.55 59.78,26.86 59.78,26.52 60.81,25.49 67.67,25.49 70.64,28.46 77.15,28.46 77.5,28.8 77.5,29.38 U$4.3
  Bottom 0.254: v41.72,10.86 42.98,10.86 43.78,10.06 43.78,8.57 JP1.23
ST1642_LE  (via drill 0.61)
  Top 0.254: v76.47,31.27 76.92,31.32 76.92,29.49 U$4.4 | R5.2 83.21,31.32 82.64,30.75 v81.84,30.75 81.84,28 81.38,27.55 81.38,25.15 90.25,16.27 90.25,14.09 92.93,12.12 94.41,12.12 94.64,11.89 94.64,8.57 93.95,7.89 90.64,7.89 89.5,6.74 88.12,6.74 82.53,1.14 18.4,1.14 16.12,3.43 16.12,4.92 16.57,5.37 22.97,5.37 23.43,5.83 JP1.40 | v21.49,18.4 18.52,21.37 18.52,24.35 U$3.4
  Bottom 0.254: v76.47,31.27 77.34,31.57 77.27,32 80.58,32 v81.84,30.75 | v21.49,18.4 21.49,7.89 23.43,5.94 JP1.40
ST1642_PWCLK  (via drill 0.61)
  Top 0.254: U$4.21 76.92,23.55 76.92,21.37 76.69,21.14 76.69,18.52 76.81,18.4 R6.1 76.58,18.52 v75.09,17.03 | v16.12,26.98 16.23,27.09 16.23,28.8 16.69,29.26 18.06,29.26 18.4,29.6 18.4,30.18 U$3.21 | v26.63,29.6 26.63,29.95 27.55,30.86 35.32,30.86 35.78,30.4 v39.89,30.4 | v51.66,19.55 51.66,14.06 53.03,12.69 62.87,12.69 v63.66,11.89
  Bottom 0.254: v16.12,26.98 24,26.98 v26.63,29.6 | v39.89,30.4 40.8,30.4 v51.66,19.55 | JP1.7 64.01,8.57 63.66,8.91 v63.66,11.89 66.18,11.89 71.32,17.03 v75.09,17.03
ST1642_SDI  (via drill 0.61)
  Top 0.254: v24.23,13.72 17.26,20.69 17.26,24.35 U$3.2
  Bottom 0.254: v24.23,13.72 26.63,11.32 35.78,11.32 36.69,12.23 45.61,12.23 48.81,9.03 48.81,8.57 JP1.19
ST1642_SDO  (via drill 0.61)
  Top 0.254: v77.61,20.8 77.61,23.55 U$4.22
  Bottom 0.254: v77.61,20.8 77.61,18.29 75.44,16.12 74.98,16.12 70.29,11.43 70.29,5.49 67.32,2.52 53.26,2.52 50.06,5.71 50.06,6.29 49.03,7.32 48.46,7.32 47.32,8.46 46.41,8.46 JP1.21
U3_OUT10  (via drill 0.61)
  Top 0.254: v22.4,22.86 22.4,24.35 U$3.10 | v83.33,5.49 85.38,7.54 R32.2 | v87.44,4.8 88.24,5.6 88.47,5.6 U$2.R
  Bottom 0.254: v22.4,22.86 22.4,13.03 25.83,9.6 26.52,9.6 27.43,8.69 27.43,8 28.35,7.09 29.03,7.09 29.95,6.17 29.95,5.49 33.49,1.94 75.21,1.94 78.75,5.49 v83.33,5.49 83.44,5.49 84.12,4.8 v87.44,4.8
U3_OUT15  (via drill 0.61)
  Top 0.254: v19.95,32.35 19.19,31.8 19.09,30.29 U$3.20 | v26.29,17.72 26.29,16.69 25.83,16.23 LED32.C
  Bottom 0.254: v19.95,32.35 16,32.35 15.2,31.55 15.2,26.63 17.6,24.23 22.97,24.23 26.29,20.92 v26.29,17.72
U4_OUT15
  Top 0.254: U$4.20 76.24,23.55 76.24,19.43 69.84,13.03 69.84,12.23 LED31.C
ULN2003_GPIO23_STP_IN1  (via drill 0.61)
  Top 0.254: v36.35,9.94 36.23,10.06 30.52,10.06 29.83,10.74 24.69,10.74 22.97,12.46 19.32,12.46 17.14,14.63 17.14,16.12 14.86,18.4 13.95,18.4 9.37,22.97 9.37,29.03 6.63,31.77 5.14,31.77 IC1.1 | v45.03,4.34 45.61,4.34 46.52,3.43 v53.61,3.43
  Bottom 0.254: v36.35,9.94 37.6,8.69 37.6,8 38.52,7.09 41.72,7.09 42.63,6.17 42.63,5.49 43.78,4.34 v45.03,4.34 | v53.61,3.43 53.61,5.49 53.95,5.83 JP1.16
ULN2003_GPIO24_STP_IN2  (via drill 0.61)
  Top 0.254: v7.2,29.95 6.63,30.52 5.14,30.52 IC1.2
  Bottom 0.254: v7.2,29.95 10.06,29.95 16.23,23.77 22.75,23.77 25.38,21.14 25.38,16.34 28.23,13.49 29.15,13.49 29.38,13.72 30.63,13.72 31.2,13.14 45.83,13.14 50.29,8.69 50.29,6.97 51.32,5.94 JP1.18
ULN2003_IN4  (via drill 0.61)
  Top 0.254: v11.2,38.06 9.14,36.01 7.43,36.01 3.77,32.35 3.77,28.8 4.46,28.12 5.03,28.12 IC1.4 | v19.27,39.89 29.15,39.89 33.38,35.66 41.6,35.66 45.72,31.55 v45.72,19.55
  Bottom 0.254: v11.2,38.06 13.03,39.89 v19.27,39.89 | v45.72,19.55 50.63,14.63 50.63,11.89 53.95,8.57 JP1.15
ULN2003_STEPPER_IN3
  Top 0.254: IC1.3 5.14,29.26 5.71,29.26 8,26.98 8,13.37 10.63,10.74 10.63,9.72 10.97,9.37 12.34,9.37 13.14,10.17 13.14,11.32 13.37,11.54 21.72,11.54 23.66,9.6 29.03,9.6 29.95,8.69 29.95,8 30.63,7.32 31.55,7.32 32.46,8.23 32.46,8.91 33.15,9.6 35.09,9.6 36.12,8.57 JP1.29
VDD  (via drill 0.61)
  Top 0.254: 91.8,5.71 93.5,5.71 95.1,7.32 95.1,21.83 94.07,22.86 SG1.+ | U$2.A 89.95,5.71 91.8,5.71 | R2.2 95.67,29.26 95.67,24.57 94.07,22.97 SG1.+ | SG1.+ 93.95,22.86 92.7,21.6 87.1,21.6 84.12,24.57 84.12,26.4 C3.1 84.85,26.45 86.3,27.9 86.3,29.7 87.3,30.6 87.3,35.1 86.6,35.7 v82.4,35.7 | 79.38,20.97 79.44,20.92 79.44,19.09 78.75,18.4 R6.2 78.64,18.29 75.44,15.09 C6.+ | 79.38,20.97 78.98,21.37 78.98,23.55 U$4.24 | SW4.A 85.95,11.2 85.95,12.46 88.2,14.4 88.2,15.77 82.94,21.03 79.44,21.03 79.38,20.97 | v10.29,7.77 9.14,6.63 8.69,6.63 LED29.A | v16.69,8.57 17.14,8.57 18.06,9.49 SW2.A | v6.29,13.14 5.03,14.4 5.03,16.46 SW1.A | 16.34,30.18 15.32,30.18 15.2,30.06 C1.1 14.97,30.06 14.86,30.06 13.03,28.23 v13.03,24.57 | 16.34,30.18 16.46,30.18 U$3.24 | v16.34,31.43 16.34,30.18 | v68.35,7.2 69.49,7.2 70.75,8.46 71.67,8.46 JP1.1 73.06,9.8 80.3,9.8 81.1,9 82.5,9 83.2,8.3 86.1,8.3 86.5,7.9 | IC2.3 79.35,5.25 81.1,3.5 83.4,3.5 86.5,6.6 86.5,7.9 | 91.8,5.71 v91.8,4.6 | 86.5,7.9 86.5,8.4 87.1,8.4 v87.3,8.6 | SW3.A 77.3,33.5 v79.5,35.7
  Bottom 0.254: JP1.1 71.78,8.57 71.78,11.32 75.44,14.97 C6.+ | v16.69,8.57 15.89,7.77 v10.29,7.77 10.29,7.89 6.29,11.89 v6.29,13.14 6.29,17.83 v13.03,24.57 | v16.34,31.43 20.92,31.43 25.83,36.35 32.58,36.35 33.6,37.38 SV3_LCD_HEADER.1 33.83,37.38 38.29,32.92 38.29,30.75 41.83,27.2 41.83,26.52 44.35,24 44.35,15.43 46.29,13.49 46.41,13.49 51.32,8.57 JP1.17 51.44,8.34 52.46,7.32 54.18,7.32 55.09,6.4 55.09,5.71 57.38,3.43 65.72,3.43 67.78,5.49 67.78,6.17 68.35,6.74 v68.35,7.2 | v87.3,8.6 91.1,8.6 92.6,7.1 92.6,5.6 v91.8,4.6 | v79.5,35.7 v82.4,35.7
VSS  (via drill 0.61)
  Top 0.254: JP1.4 69.27,5.94 71.67,5.94 JP1.2 | R1.2 11.09,39.89 7.54,39.89 4.92,37.26 C2.+ 4.8,37.15 2.86,35.2 2.86,15.32 6.74,11.43 6.74,3.66 7.2,3.2 11.89,3.2 13.14,4.46 13.14,7.43 13.37,7.66 15.09,7.66 16.23,6.51 17.72,6.51 LED30.A | v13.03,23.32 12.69,22.97 11.32,22.97 IC1.9 | v40.46,34.75 33.03,34.75 v30.52,37.26
  Bottom 0.254: v13.03,23.32 13.95,24.23 13.95,24.92 9.83,29.03 6.86,29.03 4.92,30.98 4.92,37.15 C2.+ 5.03,37.15 8.69,40.8 21.52,40.8 22.75,37.38 SV1.5 22.86,37.26 v30.52,37.26 | v40.46,34.75 89.15,34.75 95.33,28.57 95.33,22.4 82.37,5.94 71.78,5.94 JP1.2

### Text on the board
tPlace: Red | V1p13p2 | iBox Nano | 2/16/2015 | iBox Printers
tValues: GND | VDD | DATA
tSilk: 1
_tsilk: iBox Nano
_tNames: C2 | SV1 | R1 | SW3 | R38 | R3 | IC1 | LED28 | LED27 | LED26 | LED25 | LED24 | LED23 | LED22 | T1 | R30 | R5 | C1 | R2 | U$4 | LED21 | LED20 | LED19 | LED18 | LED17 | LED16 | LED15 | C3 | U$3 | SG1 | LED14 | LED13 | LED12 | LED11 | LED10 | LED9 | LED8 | R4 | R6 | SW4 | SW1 | LED7 | LED6 | LED5 | LED4 | LED3 | LED2 | LED1 | LED31 | R51 | LED32 | R36 | SW2 | C6 | R39 | R32 | U$2 | R33 | R37 | IC2 | LED29 | LED30 | JP1 | R52 | R55